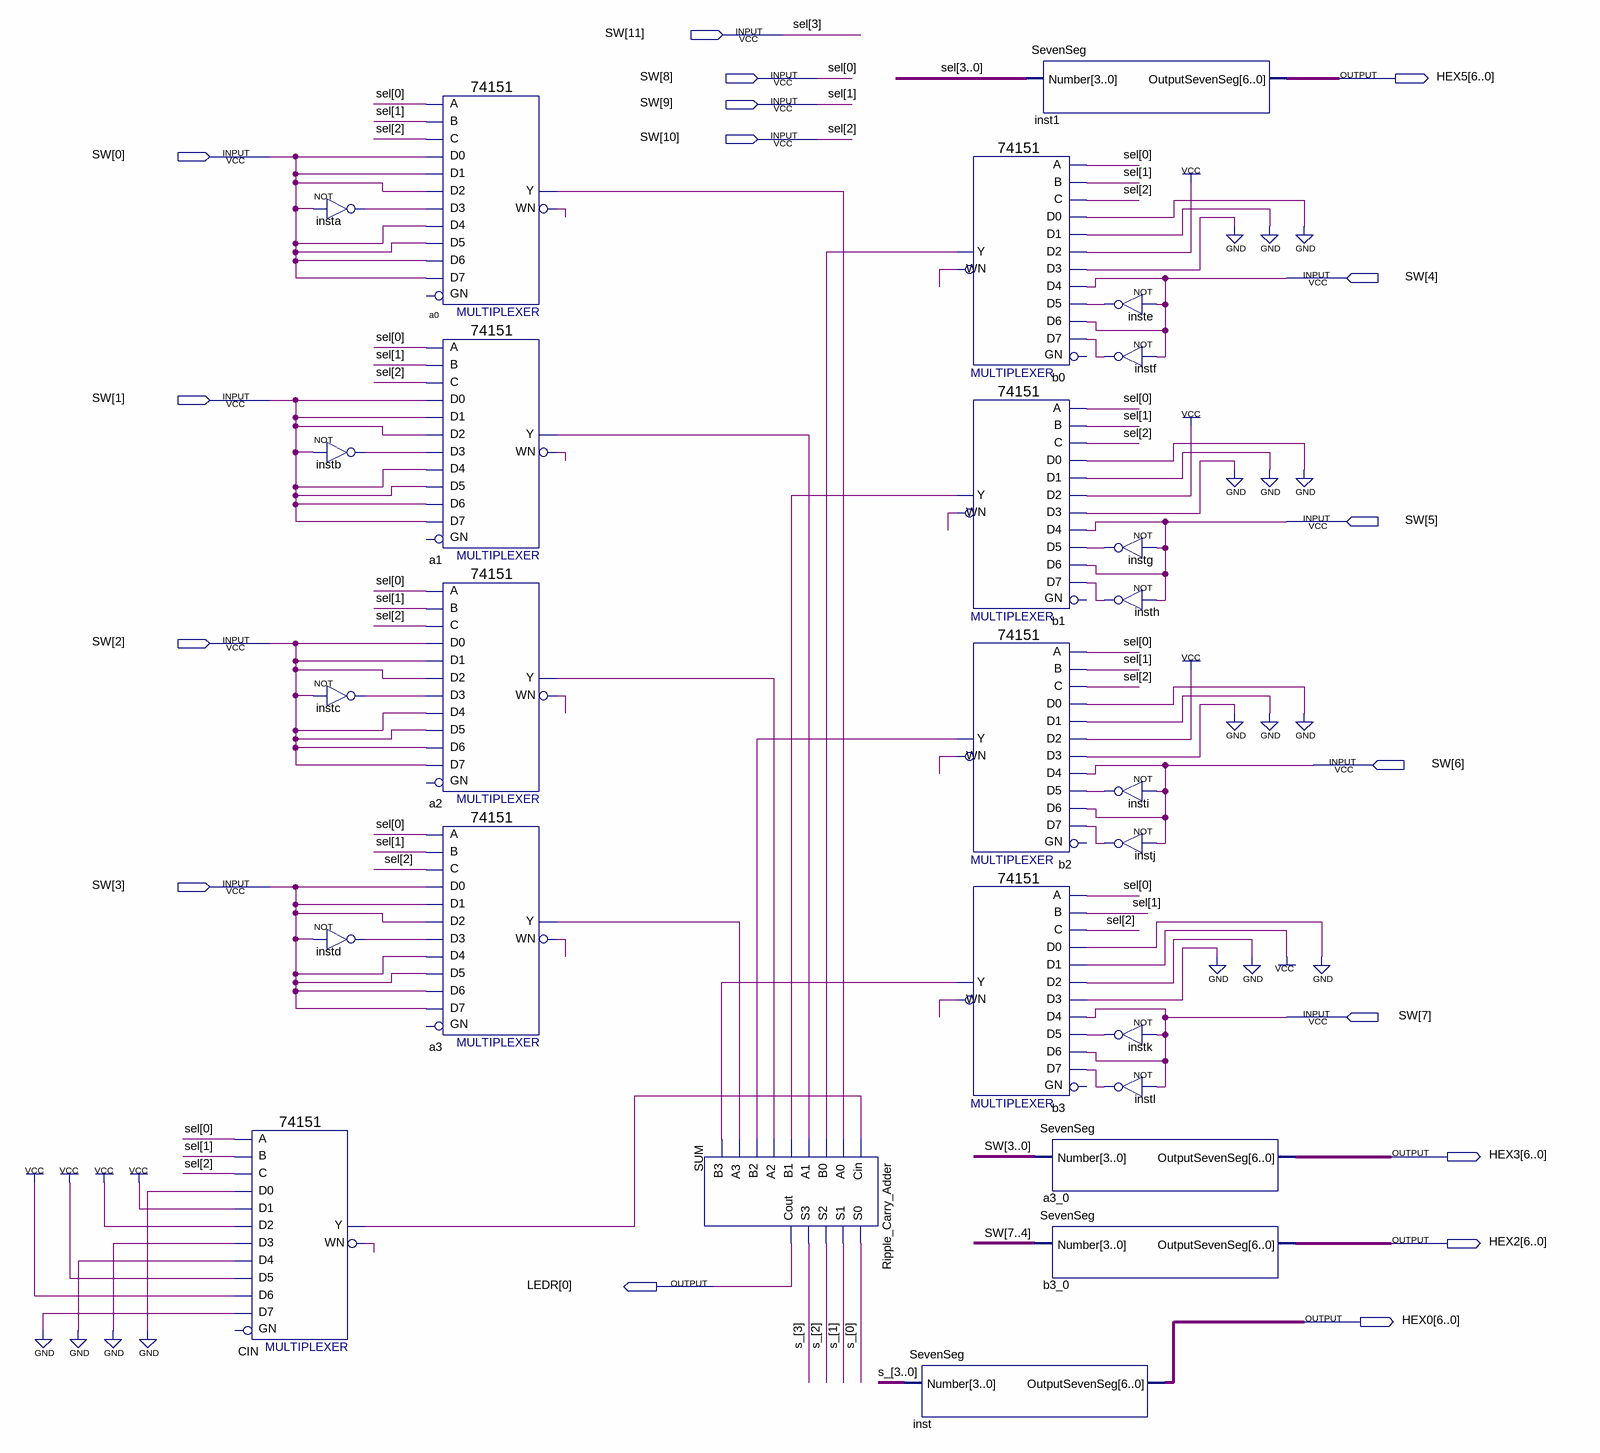
[diagram p0: schematic sheet]
// Quartus schematic Lab6ALU.bdf as structural Verilog: 26 symbols, 17 pins
module Lab6ALU (
  input  [11:0] SW,
  output [6:0] HEX5,
  output [6:0] HEX3,
  output [6:0] HEX2,
  output [0:0] LEDR,
  output [6:0] HEX0
);

  wire a0_wn, a0_y, a1_wn, a1_y, a2_wn, a2_y, a3_wn, a3_y, b0_wn, b0_y, b1_wn, b1_y, b2_wn, b2_y, b3_wn,
       b3_y, CIN_wn, CIN_y, insta_out, instb_out, instc_out, instd_out, inste_out, instf_out, instg_out,
       insth_out, insti_out, instj_out, instk_out, instl_out;
  wire [3:0] s_;

  \74151  CIN (
    .C(SW[10]), .B(SW[9]), .A(SW[8]), .D5(1'b1), .D0(1'b0), .D1(1'b1), .D4(1'b0), .D3(1'b0), .D2(1'b1),
    .D6(1'b1), .D7(1'b0), .Y(CIN_y), .WN(CIN_wn));  // open: GN
  not insta (insta_out, SW[0]);
  not instb (instb_out, SW[1]);
  not instc (instc_out, SW[2]);
  not instd (instd_out, SW[3]);
  \74151  a0 (
    .C(SW[10]), .B(SW[9]), .A(SW[8]), .D5(SW[0]), .D0(SW[0]), .D1(SW[0]), .D4(SW[0]), .D3(insta_out),
    .D2(SW[0]), .D6(SW[0]), .D7(SW[0]), .Y(a0_y), .WN(a0_wn));  // open: GN
  \74151  a1 (
    .C(SW[10]), .B(SW[9]), .A(SW[8]), .D5(SW[1]), .D0(SW[1]), .D1(SW[1]), .D4(SW[1]), .D3(instb_out),
    .D2(SW[1]), .D6(SW[1]), .D7(SW[1]), .Y(a1_y), .WN(a1_wn));  // open: GN
  \74151  a2 (
    .C(SW[10]), .B(SW[9]), .A(SW[8]), .D5(SW[2]), .D0(SW[2]), .D1(SW[2]), .D4(SW[2]), .D3(instc_out),
    .D2(SW[2]), .D6(SW[2]), .D7(SW[2]), .Y(a2_y), .WN(a2_wn));  // open: GN
  \74151  a3 (
    .C(SW[10]), .B(SW[9]), .A(SW[8]), .D5(SW[3]), .D0(SW[3]), .D1(SW[3]), .D4(SW[3]), .D3(instd_out),
    .D2(SW[3]), .D6(SW[3]), .D7(SW[3]), .Y(a3_y), .WN(a3_wn));  // open: GN
  Ripple_Carry_Adder SUM (
    .Cin(CIN_y), .A0(a0_y), .B0(b0_y), .A1(a1_y), .B1(b1_y), .A2(a2_y), .B2(b2_y), .A3(a3_y), .B3(b3_y),
    .S0(s_[0]), .S1(s_[1]), .S2(s_[2]), .S3(s_[3]), .Cout(LEDR[0]));
  SevenSeg inst (.Number(s_), .OutputSevenSeg(HEX0));
  \74151  b0 (
    .C(SW[10]), .B(SW[9]), .A(SW[8]), .D5(inste_out), .D0(1'b0), .D1(1'b0), .D4(SW[4]), .D3(1'b0), .D2(1'b1),
    .D6(SW[4]), .D7(instf_out), .Y(b0_y), .WN(b0_wn));  // open: GN
  \74151  b1 (
    .C(SW[10]), .B(SW[9]), .A(SW[8]), .D5(instg_out), .D0(1'b0), .D1(1'b0), .D4(SW[5]), .D3(1'b0), .D2(1'b1),
    .D6(SW[5]), .D7(insth_out), .Y(b1_y), .WN(b1_wn));  // open: GN
  \74151  b2 (
    .C(SW[10]), .B(SW[9]), .A(SW[8]), .D5(insti_out), .D0(1'b0), .D1(1'b0), .D4(SW[6]), .D3(1'b0), .D2(1'b1),
    .D6(SW[6]), .D7(instj_out), .Y(b2_y), .WN(b2_wn));  // open: GN
  \74151  b3 (
    .C(SW[10]), .B(SW[9]), .A(SW[8]), .D5(instk_out), .D0(1'b0), .D1(1'b1), .D4(SW[7]), .D3(1'b0), .D2(1'b0),
    .D6(SW[7]), .D7(instl_out), .Y(b3_y), .WN(b3_wn));  // open: GN
  SevenSeg inst1 (.Number(SW[11:8]), .OutputSevenSeg(HEX5));
  SevenSeg a3_0 (.Number(SW[3:0]), .OutputSevenSeg(HEX3));
  SevenSeg b3_0 (.Number(SW[7:4]), .OutputSevenSeg(HEX2));
  not inste (inste_out, SW[4]);
  not instf (instf_out, SW[4]);
  not instg (instg_out, SW[5]);
  not insth (insth_out, SW[5]);
  not insti (insti_out, SW[6]);
  not instj (instj_out, SW[6]);
  not instk (instk_out, SW[7]);
  not instl (instl_out, SW[7]);

  // Other names for the same wires on the sheet: sel[3:0] = SW[11:8]
endmodule
